# Altium schematic sheet Analogicas_Corriente.SchDoc: Analogicas Corriente
size A3; CompanyName: TM; DrawnBy: Juan Tinazzo; SheetNumber: 5; SheetTotal: 7; Number: CB_AC; Company: TM
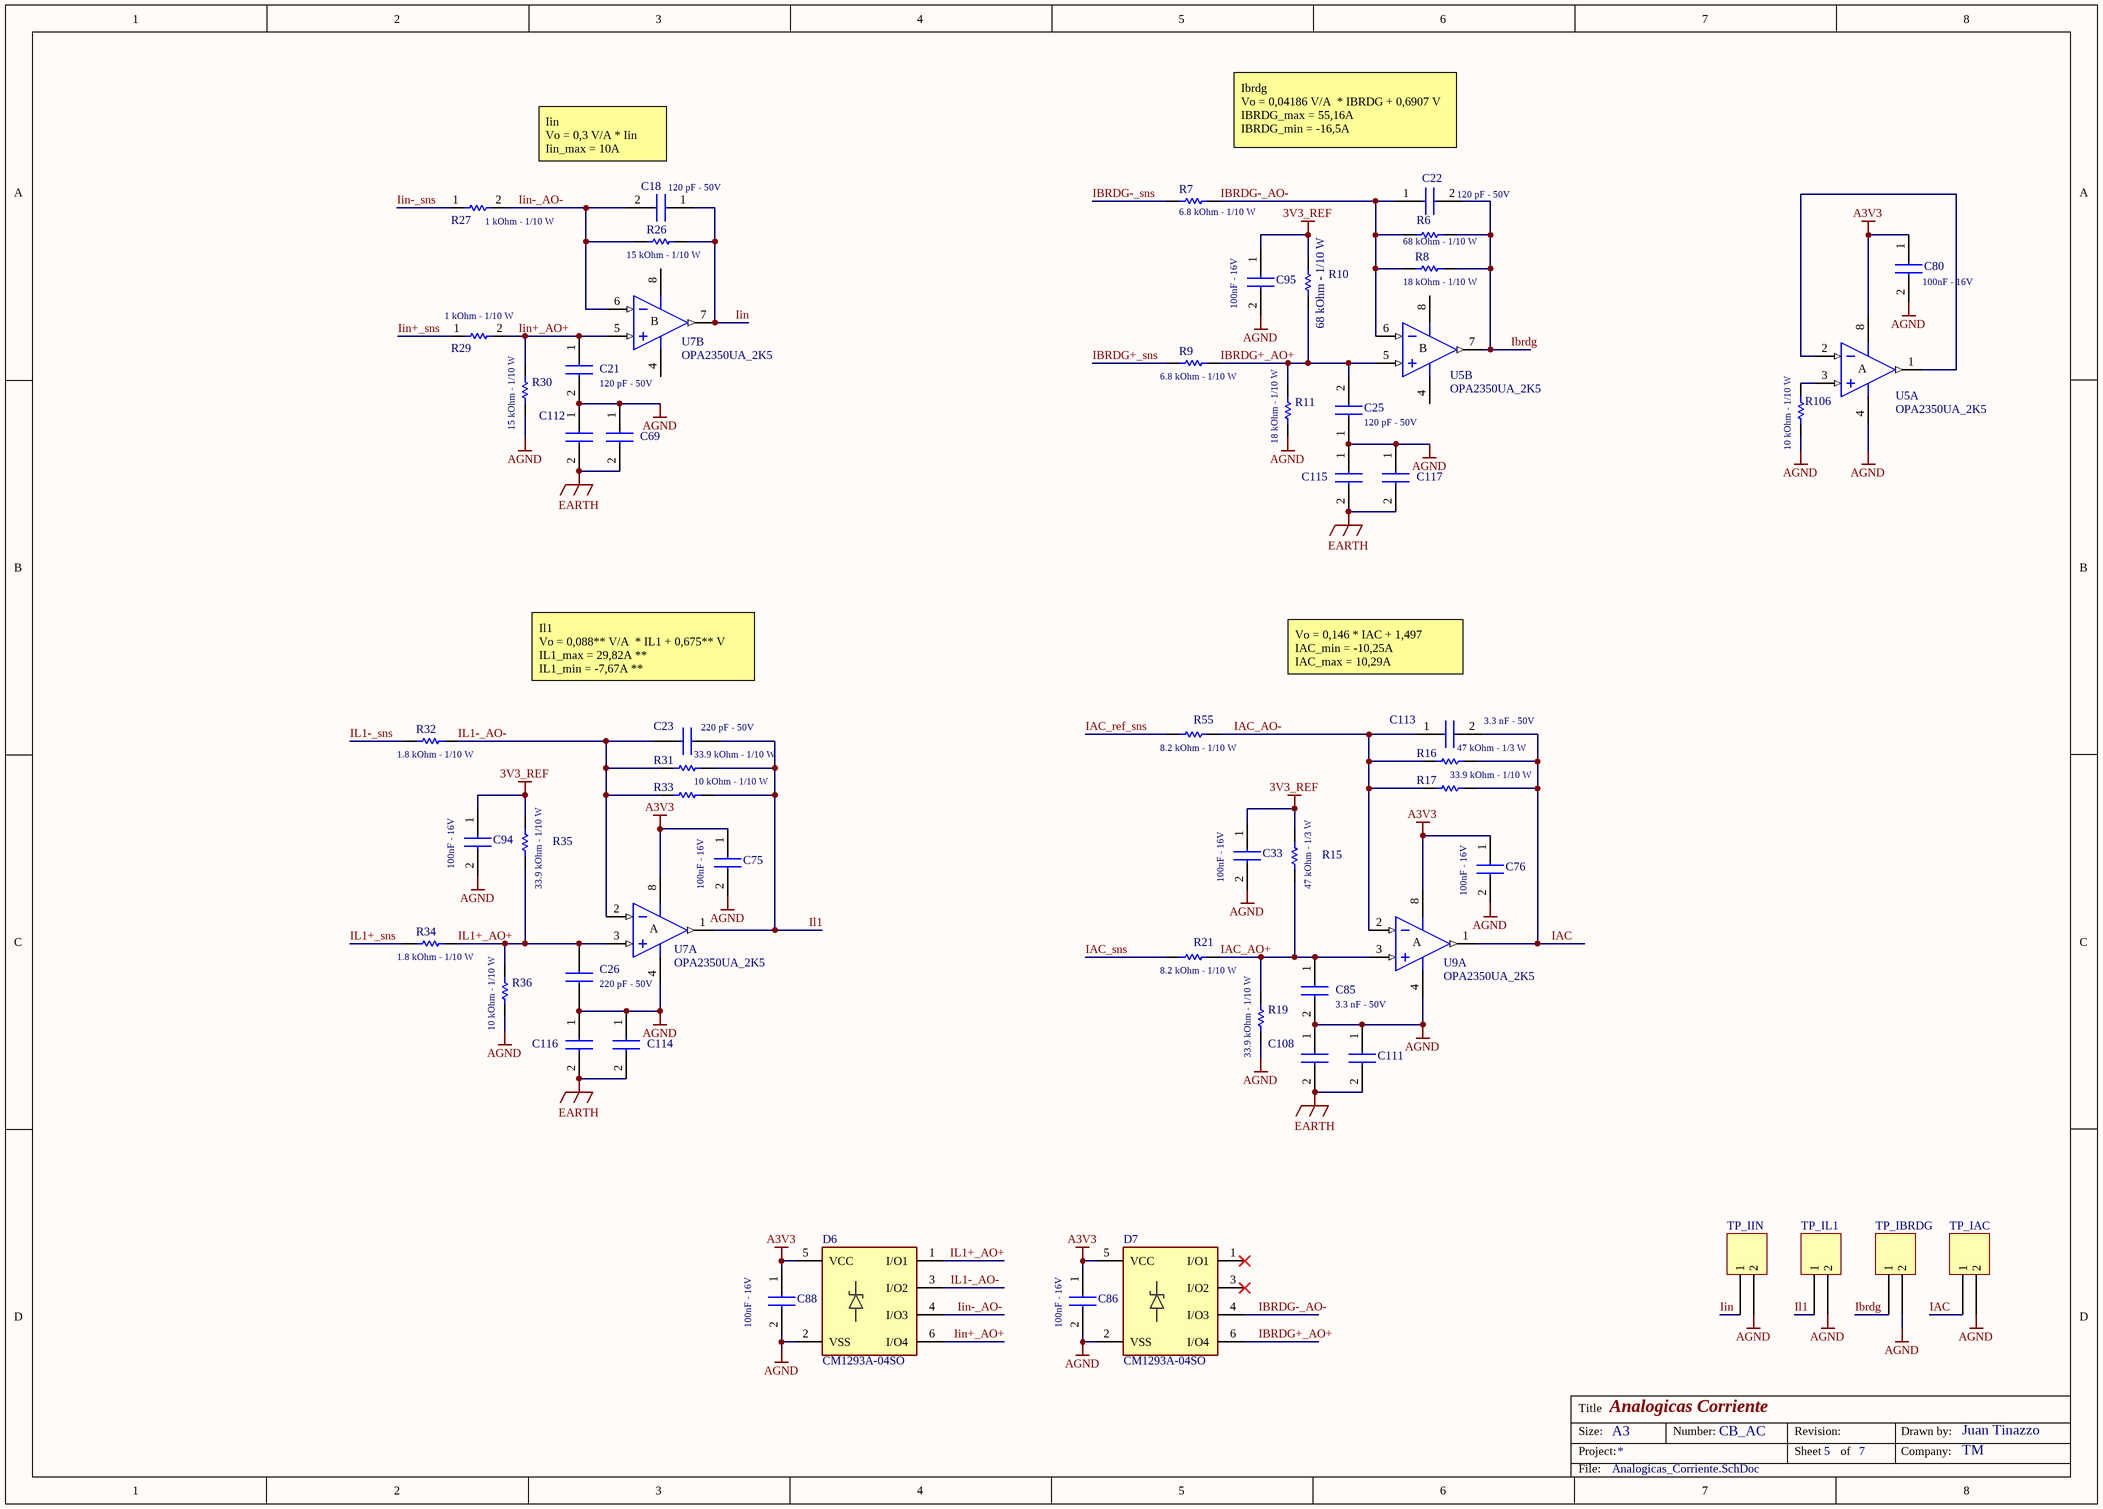
[diagram p0: Analogicas_Corriente.SchDoc]

## Parts
C18  value 120 pF - 50V  [C0603]  (hidden comment: 120p)
C21  value 120 pF - 50V  [C0603]  (hidden comment: C0603C121J5GAC7411)
C22  value 120 pF - 50V  [C0603]  (hidden comment: C0603C121J5GAC7411)
C23  value 220 pF - 50V  [C0603]  (hidden comment: 220p)
C25  value 120 pF - 50V  [C0603]  (hidden comment: C0603C121J5GAC7411)
C26  value 220 pF - 50V  [C0603]  (hidden comment: 220p)
C33  value 100nF - 16V  [CAPC1608X95N]  (hidden comment: 100n 16V 0603)
C69  C1206C102KGRACAUTO  [C1206]  (value not drawn)
C75  value 100nF - 16V  [CAPC1608X95N]  (hidden comment: 100n 16V 0603)
C76  value 100nF - 16V  [CAPC1608X95N]  (hidden comment: 100n 16V 0603)
C80  value 100nF - 16V  [CAPC1608X95N]  (hidden comment: 100n 16V 0603)
C85  value 3.3 nF - 50V  [C0603]  (hidden comment: C0603C121J5GAC7411)
C86  value 100nF - 16V  [CAPC1608X95N]  (hidden comment: 100n 16V 0603)
C88  value 100nF - 16V  [CAPC1608X95N]  (hidden comment: 100n 16V 0603)
C94  value 100nF - 16V  [CAPC1608X95N]  (hidden comment: 100n 16V 0603)
C95  value 100nF - 16V  [CAPC1608X95N]  (hidden comment: 100n 16V 0603)
C108  LDEQD1100KA5N00  [C_2220_1206]  (value not drawn)
C111  LDEQD1100KA5N00  [C_2220_1206]  (value not drawn)
C112  C1206C102KGRACAUTO  [C1206]  (value not drawn)
C113  value 3.3 nF - 50V  [C0603]  (hidden comment: C0603C121J5GAC7411)
C114  C1206C102KGRACAUTO  [C1206]  (value not drawn)
C115  C1206C102KGRACAUTO  [C1206]  (value not drawn)
C116  C1206C102KGRACAUTO  [C1206]  (value not drawn)
C117  C1206C102KGRACAUTO  [C1206]  (value not drawn)
D6  CM1293A-04SO  [SOT95P275X110-6N]
D7  CM1293A-04SO  [SOT95P275X110-6N]
R6  value 68 kOhm - 1/10 W  [RESC1608X55N]  (hidden comment: 68k)
R7  value 6.8 kOhm - 1/10 W  [RESC1608X50N]  (hidden comment: CRCW06036K80FKEA)
R8  value 18 kOhm - 1/10 W  [RESC1608X50N]  (hidden comment: CRCW060318K0FKEA)
R9  value 6.8 kOhm - 1/10 W  [RESC1608X50N]  (hidden comment: CRCW06036K80FKEA)
R10  68 kOhm - 1/10 W  [RESC1608X55N]
R11  value 18 kOhm - 1/10 W  [RESC1608X50N]  (hidden comment: CRCW060318K0FKEA)
R15  value 47 kOhm - 1/3 W  [RESC1608X50N]  (hidden comment: 47k)
R16  value 47 kOhm - 1/3 W  [RESC1608X50N]  (hidden comment: 47k)
R17  value 33.9 kOhm - 1/10 W  [RESC1608X50N]  (hidden comment: CRCW060339K0FKEA)
R19  value 33.9 kOhm - 1/10 W  [RESC1608X50N]  (hidden comment: CRCW060339K0FKEA)
R21  value 8.2 kOhm - 1/10 W  [RESC1608X55N]  (hidden comment: 8k2)
R26  value 15 kOhm - 1/10 W  [RESC1608X55N]  (hidden comment: CRCW060315K0FKEAC)
R27  value 1 kOhm - 1/10 W  [RESC1608X55N]  (hidden comment: CRCW06031K00FKEAC)
R29  value 1 kOhm - 1/10 W  [RESC1608X55N]  (hidden comment: CRCW06031K00FKEAC)
R30  value 15 kOhm - 1/10 W  [RESC1608X55N]  (hidden comment: CRCW060315K0FKEAC)
R31  value 33.9 kOhm - 1/10 W  [RESC1608X50N]  (hidden comment: CRCW060339K0FKEA)
R32  value 1.8 kOhm - 1/10 W  [RESC1608X55N]  (hidden comment: CRCW06031K80FKEAC)
R33  value 10 kOhm - 1/10 W  [RESC1608X50N]  (hidden comment: CRCW060310K0FKEA)
R34  value 1.8 kOhm - 1/10 W  [RESC1608X55N]  (hidden comment: CRCW06031K80FKEAC)
R35  value 33.9 kOhm - 1/10 W  [RESC1608X50N]  (hidden comment: CRCW060339K0FKEA)
R36  value 10 kOhm - 1/10 W  [RESC1608X50N]  (hidden comment: CRCW060310K0FKEA)
R55  value 8.2 kOhm - 1/10 W  [RESC1608X55N]  (hidden comment: 8k2)
R106  value 10 kOhm - 1/10 W  [RESC1608X50N]  (hidden comment: CRCW060310K0FKEA)
TP_IAC  Test_Point  [Test Point]  (value not drawn)
TP_IBRDG  Test_Point  [Test Point]  (value not drawn)
TP_IIN  Test_Point  [Test Point]  (value not drawn)
TP_IL1  Test_Point  [Test Point]  (value not drawn)
U5  OPA2350UA_2K5  [SOIC127P600X175-8N]  (parts A,B of 2)
U7  OPA2350UA_2K5  [SOIC127P600X175-8N]  (parts A,B of 2)
U9  OPA2350UA_2K5  [SOIC127P600X175-8N]  (part A of 2)

## Nets
3V3_REF: C33.1 C94.1 C95.1 R10.2 R15.2 R35.2
A3V3: C75.1 C76.1 C80.1 C86.1 C88.1 D6.5(VCC) D7.5(VCC) U5.8(V+) U7.8(V+) U9.8(V+)
AGND: C21.2 C25.1 C26.1 C33.2 C69.1 C75.2 C76.2 C80.2 C85.2 C86.2 C88.2 C94.2 C95.2 C108.1 C111.1 C112.1 C114.1 C115.1 C116.1 C117.1 D6.2(VSS) D7.2(VSS) R11.1 R19.1 R30.1 R36.2 R106.1 TP_IAC.2 TP_IBRDG.2 TP_IIN.2 TP_IL1.2 U5.4(V-) U7.4(V-) U9.4(V-)
EARTH: C69.2 C108.2 C111.2 C112.2 C114.2 C115.2 C116.2 C117.2
IAC: C113.2 R16.1 R17.1 TP_IAC.1 U9.1(OUT)
IAC_AO+: C85.1 R15.1 R19.2 R21.2 U9.3(IN+)
IAC_AO-: C113.1 R16.2 R17.2 R55.2 U9.2(IN-)
IAC_ref_sns: R55.1
IAC_sns: R21.1
Ibrdg: C22.2 R6.1 R8.1 TP_IBRDG.1 U5.7(OUT)
IBRDG+_AO+: C25.2 D7.6(I/O4) R9.1 R10.1 R11.2 U5.5(IN+)
IBRDG+_sns: R9.2
IBRDG-_AO-: C22.1 D7.4(I/O3) R6.2 R7.1 R8.2 U5.6(IN-)
IBRDG-_sns: R7.2
Iin: C18.1 R26.1 TP_IIN.1 U7.7(OUT)
Iin+_AO+: C21.1 D6.6(I/O4) R29.2 R30.2 U7.5(IN+)
Iin+_sns: R29.1
Iin-_AO-: C18.2 D6.4(I/O3) R26.2 R27.2 U7.6(IN-)
Iin-_sns: R27.1
Il1: C23.2 R31.1 R33.1 TP_IL1.1 U7.1(OUT)
IL1+_AO+: C26.2 D6.1(I/O1) R34.1 R35.1 R36.1 U7.3(IN+)
IL1+_sns: R34.2
IL1-_AO-: C23.1 D6.3(I/O2) R31.2 R32.1 R33.2 U7.2(IN-)
IL1-_sns: R32.2
NetR106_2: R106.2 U5.3(IN+)
NetU5_1: U5.1(OUT) U5.2(IN-)

Not connected (* = marked no-connect by the designer): D7 1(I/O1)* 3(I/O2)*

## Notes on the sheet
- Iin
  Vo = 0,3 V/A * Iin
  Iin_max = 10A
- Ibrdg
  Vo = 0,04186 V/A  * IBRDG + 0,6907 V
  IBRDG_max = 55,16A
  IBRDG_min = -16,5A
- Il1
  Vo = 0,088** V/A  * IL1 + 0,675** V
  IL1_max = 29,82A **
  IL1_min = -7,67A **
- Vo = 0,146 * IAC + 1,497
  IAC_min = -10,25A
  IAC_max = 10,29A
- Title
- Size:
- Project:
- A3
- Number:
- Revision:
- Sheet
- of
- Drawn by:
- Company:
- File:
- (in symbol OPA2350UA_2K5, part A) A
- (in symbol OPA2350UA_2K5, part B) B

## Library data of the parts
C18 C21 C22 C25 C85 C113 = C0603C121J5GAC7411: Capacitor; Manufacturer_Name: KEMET; Datasheet Link: https://content.kemet.com/datasheets/KEM_C1003_C0G_SMD.pdf; Height: 0.87mm; Manufacturer_Part_Number: C0603C121J5GAC7411; Mouser Part Number: 80-C0603C121J5GACLR; Mouser Price/Stock: https://www.mouser.co.uk/ProductDetail/KEMET/C0603C121J5GAC7411?qs=jZv2EoxFq37MWDKazt2ZvQ%3D%3D
C23 C26 = C0603C221J5HACAUTO: Capacitor; Manufacturer_Name: KEMET; Datasheet Link: https://content.kemet.com/datasheets/KEM_C1007_X8R_ULTRA_150C_SMD.pdf; Height: 0.87mm; Manufacturer_Part_Number: C0603C221J5HACAUTO; Mouser Part Number: 80-C0603C221J5HAUTO; Mouser Price/Stock: https://www.mouser.co.uk/ProductDetail/KEMET/C0603C221J5HACAUTO?qs=j%252B1pi9TdxUZayjzZ3rh80g%3D%3D
C33 C75 C76 C80 C86 C88 C94 C95 = EMK107B7104KA-T: Capacitor; Manufacturer_Name: TAIYO YUDEN; Datasheet Link: http://www.farnell.com/datasheets/746258.pdf; Height: 0.95mm; Manufacturer_Part_Number: EMK107B7104KA-T; Mouser Part Number: 963-EMK107B7104KA-T; Arrow Part Number: EMK107B7104KA-T; Arrow Price/Stock: https://www.arrow.com/en/products/emk107b7104ka-t/taiyo-yuden
  C33 C94 C95: Mouser Price/Stock: https://www.mouser.co.uk/ProductDetail/TAIYO-YUDEN/EMK107B7104KA-T?qs=I6KAKw0tg2ybqzX8hKPgfw%3D%3D
  C75 C76 C80 C86 C88: Mouser Price/Stock: https://www.mouser.co.uk/ProductDetail/Taiyo-Yuden/EMK107B7104KA-T?qs=I6KAKw0tg2ybqzX8hKPgfw%3D%3D
C69 C112 C114-C117 = C1206C102KGRACAUTO: Capacitor; Manufacturer_Name: KEMET; Value: 1nF - 2000V; Datasheet Link: https://content.kemet.com/datasheets/KEM_C1076_X7R_HV_AUTO_SMD.pdf; Manufacturer_Part_Number: C1206C102KGRACAUTO; Mouser Part Number: 80-C1206C102KGRAUTO; Mouser Price/Stock: https://www.mouser.co.uk/ProductDetail/KEMET/C1206C102KGRACAUTO?qs=02kMkzikyGKenJNcwYLRQw%3D%3D; Arrow Part Number: C1206C102KGRACAUTO; Arrow Price/Stock: https://www.arrow.com/en/products/c1206c102kgracauto/kemet-corporation?region=nac
C108 C111 = LDEQD1100KA5N00: Capacitor; Manufacturer_Name: KEMET; Value: 1nF - 1000V; Datasheet Link: https://content.kemet.com/datasheets/KEM_F3078_LDE.pdf; Height: 1.9mm; Manufacturer_Part_Number: LDEQD1100KA5N00; Mouser Part Number: 80-LDEQD1100KA5N00; Mouser Price/Stock: https://www.mouser.co.uk/ProductDetail/KEMET/LDEQD1100KA5N00?qs=MdJgNetHbfkxq2yA6XdGCw%3D%3D
D6 D7 = CM1293A-04SO: TVS Diode (Bi-directional); Manufacturer_Name: onsemi; Manufacturer_Part_Number: D5V0P4UR6SO-7; Value: 4CH - Unidireccional - 3.3V - 800mW; Datasheet Link: https://www.onsemi.com/pub/Collateral/CM1293A-04SO-D.PDF; Height: 1.1mm; Mouser Part Number: 748-CM1293A-04SO; Mouser Price/Stock: https://www.mouser.co.uk/ProductDetail/onsemi/CM1293A-04SO?qs=LMMkZCEv%2Ff0mlcOKTEwKBg%3D%3D; Arrow Part Number: CM1293A-04SO; Arrow Price/Stock: https://www.arrow.com/en/products/cm1293a-04so/on-semiconductor?region=nac
R6 R10 = ERJ-S03F6802V: Resistor; Manufacturer_Name: Panasonic; Datasheet Link: https://industrial.panasonic.com/cdbs/www-data/pdf/RDP0000/AOA0000C334.pdf; Height: 0.55mm; Manufacturer_Part_Number: ERJ-S03F6802V; Mouser Part Number: 667-ERJ-S03F6802V; Mouser Price/Stock: https://www.mouser.co.uk/ProductDetail/Panasonic/ERJ-S03F6802V?qs=Zyl8A9hlmJrefgHdaBD9Yg%3D%3D
  R10: Value: 68 kOhm - 1/10 W
R7 R9 = CRCW06036K80FKEA: Resistor; Manufacturer_Name: Vishay; Datasheet Link: http://www.vishay.com/docs/20035/dcrcwe3.pdf; Height: 0.5mm; Manufacturer_Part_Number: CRCW06036K80FKEA; Mouser Part Number: 71-CRCW0603-6.8K-E3; Mouser Price/Stock: https://www.mouser.co.uk/ProductDetail/Vishay-Dale/CRCW06036K80FKEA?qs=AJ8X0UdFcuT%2FTCHOUTZCrw%3D%3D; Arrow Part Number: CRCW06036K80FKEA; Arrow Price/Stock: https://www.arrow.com/en/products/crcw06036k80fkea/vishay
R8 R11 = CRCW060318K0FKEA: Resistor; Manufacturer_Name: Vishay; Datasheet Link: http://www.vishay.com/docs/20035/dcrcwe3.pdf; Height: 0.5mm; Manufacturer_Part_Number: CRCW060318K0FKEA; Mouser Part Number: 71-CRCW0603-18K-E3; Mouser Price/Stock: https://www.mouser.co.uk/ProductDetail/Vishay-Dale/CRCW060318K0FKEA?qs=Ihd9YkxhV%2F2Qiuqr%2FyuzaQ%3D%3D; Arrow Part Number: CRCW060318K0FKEA; Arrow Price/Stock: https://www.arrow.com/en/products/crcw060318k0fkea/vishay?region=nac
R15 R16 = CRCW060347K0FKEAHP: Resistor; Manufacturer_Name: Vishay; Datasheet Link: http://www.farnell.com/datasheets/1885357.pdf; Height: 0.5mm; Manufacturer_Part_Number: CRCW060347K0FKEAHP; Mouser Part Number: 71-CRCW060347K0FKEAH; Mouser Price/Stock: https://www.mouser.co.uk/ProductDetail/Vishay-Dale/CRCW060347K0FKEAHP?qs=k2%2FDWSARqgGdf8xU6XXKnw%3D%3D; Arrow Part Number: CRCW060347K0FKEAHP; Arrow Price/Stock: https://www.arrow.com/en/products/crcw060347k0fkeahp/vishay?region=nac
R17 R19 R31 R35 = CRCW060339K0FKEA: Resistor; Manufacturer_Name: Vishay; Datasheet Link: http://www.vishay.com/docs/20035/dcrcwe3.pdf; Height: 0.5mm; Manufacturer_Part_Number: CRCW060339K0FKEA; Mouser Part Number: 71-CRCW0603-39K-E3; Mouser Price/Stock: https://www.mouser.co.uk/ProductDetail/Vishay-Dale/CRCW060339K0FKEA?qs=LdkvS58n%252BakpUVpOJpUwUw%3D%3D; Arrow Part Number: CRCW060339K0FKEA; Arrow Price/Stock: https://www.arrow.com/en/products/crcw060339k0fkea/vishay
R21 R55 = CRG0603F8K2: Resistor; Manufacturer_Name: TE Connectivity; Datasheet Link: https://www.te.com/commerce/DocumentDelivery/DDEController?Action=srchrtrv&DocNm=1773204&DocType=Data%20Sheet&DocLang=English&PartCntxt=1623004-1&DocFormat=pdf; Height: 0.55mm; Manufacturer_Part_Number: CRG0603F8K2; Mouser Part Number: 279-CRG0603F8K2; Mouser Price/Stock: https://www.mouser.com/Search/Refine.aspx?Keyword=279-CRG0603F8K2; Arrow Part Number: CRG0603F8K2; Arrow Price/Stock: https://www.arrow.com/en/products/crg0603f8k2/te-connectivity
R26 R30 = CRCW060315K0FKEAC: Resistor; Manufacturer_Name: Vishay; Datasheet Link: https://www.arrow.com/en/products/crcw060315k0fkeac/vishay; Height: 0.55mm; Manufacturer_Part_Number: CRCW060315K0FKEAC; Mouser Part Number: 71-CRCW060315K0FKEAC; Mouser Price/Stock: https://www.mouser.co.uk/ProductDetail/Vishay-Dale/CRCW060315K0FKEAC?qs=E3Y5ESvWgWOCeZLgjE8pIw%3D%3D; Arrow Part Number: CRCW060315K0FKEAC; Arrow Price/Stock: https://www.arrow.com/en/products/crcw060315k0fkeac/vishay?region=nac
R27 R29 = CRCW06031K00FKEAC: Resistor; Manufacturer_Name: Vishay; Datasheet Link: https://www.vishay.com/docs/28773/crcwce3.pdf; Height: 0.55mm; Manufacturer_Part_Number: CRCW06031K00FKEAC; Mouser Part Number: 71-CRCW06031K00FKEAC; Mouser Price/Stock: https://www.mouser.co.uk/ProductDetail/Vishay-Dale/CRCW06031K00FKEAC?qs=E3Y5ESvWgWOQ7ePIWbGVFg%3D%3D; Arrow Part Number: CRCW06031K00FKEAC; Arrow Price/Stock: https://www.arrow.com/en/products/crcw06031k00fkeac/vishay?region=nac
R32 R34 = CRCW06031K80FKEAC: Resistor; Manufacturer_Name: Vishay; Datasheet Link: http://www.vishay.com/docs/28773/crcwce3.pdf; Height: 0.55mm; Manufacturer_Part_Number: CRCW06031K80FKEAC; Mouser Part Number: 71-CRCW06031K80FKEAC; Mouser Price/Stock: https://www.mouser.co.uk/ProductDetail/Vishay-Dale/CRCW06031K80FKEAC?qs=E3Y5ESvWgWO9QbyRuawq%2Fw%3D%3D; Arrow Part Number: CRCW06031K80FKEAC; Arrow Price/Stock: https://www.arrow.com/en/products/crcw06031k80fkeac/vishay
R33 R36 R106 = CRCW060310K0FKEA: Resistor; Manufacturer_Name: Vishay; Datasheet Link: http://www.vishay.com/docs/20035/dcrcwe3.pdf; Height: 0.5mm; Manufacturer_Part_Number: CRCW060310K0FKEA; Mouser Part Number: 71-CRCW0603-10K-E3; Mouser Price/Stock: https://www.mouser.co.uk/ProductDetail/Vishay-Dale/CRCW060310K0FKEA?qs=pAO1Z172M84BVnhDjtnsoQ%3D%3D; Arrow Part Number: CRCW060310K0FKEA; Arrow Price/Stock: https://www.arrow.com/en/products/crcw060310k0fkea/vishay?region=nac
TP_IAC TP_IBRDG TP_IIN TP_IL1 = Test_Point: Punta Prueba Osciloscopio; Manufacturer_Part_Number: PCB; Value: TP
U5 U7 U9 = OPA2350UA_2K5: Integrated Circuit; Manufacturer_Name: Texas Instruments; Manufacturer_Part_Number: OPA2350UA/2K5; Value: AO de alta velocidad, fuente unica, rail to rail; Datasheet Link: http://www.ti.com/lit/gpn/opa2350; Height: 1.75mm; Mouser Part Number: 595-OPA2350UA/2K5; Mouser Price/Stock: https://www.mouser.co.uk/ProductDetail/Texas-Instruments/OPA2350UA-2K5?qs=7nS3%252BbEUL6t75JUF5jEhbw%3D%3D; Arrow Part Number: OPA2350UA/2K5; Arrow Price/Stock: https://www.arrow.com/en/products/opa2350ua2k5/texas-instruments?region=nac